# Altium project MB1397.PrjPcb (part 3 of 9)

## Sheet MotorControl.SchDoc: Motor Control
size A3; Date: Not used; ApprovedBy: Not used; CheckedBy: Not used; Author: Not used; CompanyName: STMicroelectronics; DrawnBy: Not used; Engineer: Not used; Organization: Not used; Address1: Not used; Address2: Not used; Address3: Not used; Address4: Not used; DocumentNumber: Not used; Revision: Not used; SheetNumber: 16; SheetTotal: 22; CurrentTime: Not used; CurrentDate: Not used; Time: Not used; DocumentFullPathAndName: Not used; DocumentName: Not used; ModifiedDate: Not used; ImagePath: Not used; ProjectName: Not used; Application_BuildNumber: Not used
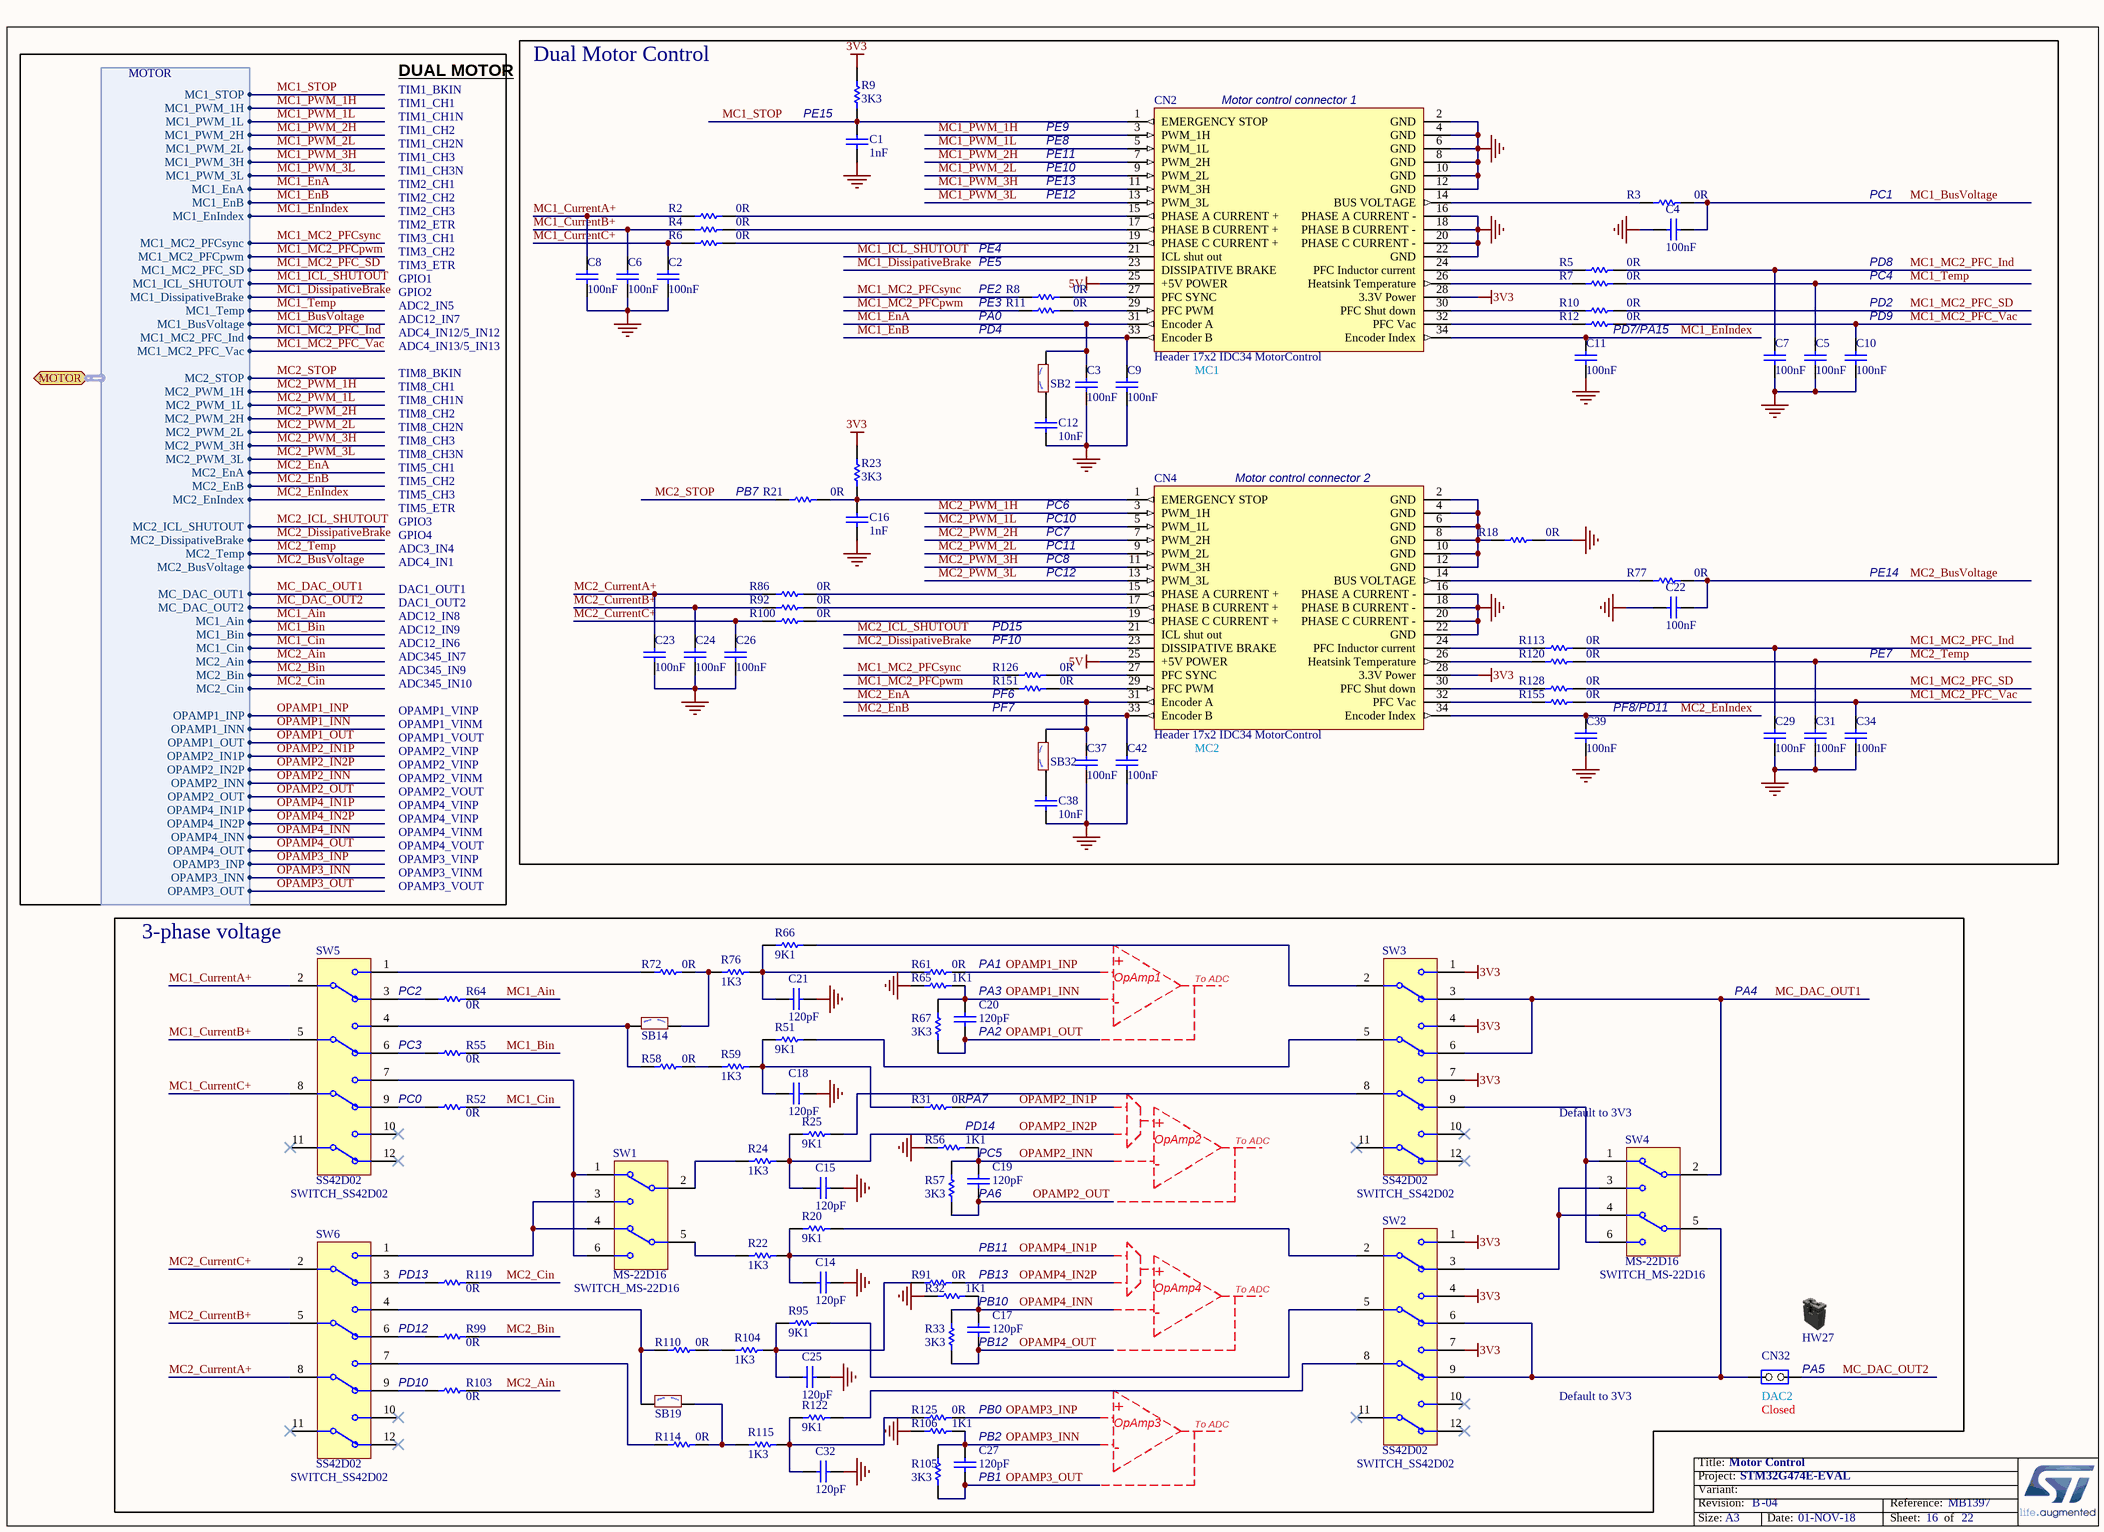
[diagram p8: MotorControl.SchDoc]

### Parts
C1  value 1nF  [C0402]  (hidden comment: Capacitor)
C2  value 100nF  [C0402]  (hidden comment: Capacitor)
C3  value 100nF  [C0402]  (hidden comment: Capacitor)
C4  value 100nF  [C0402]  (hidden comment: Capacitor)
C5  value 100nF  [C0402]  (hidden comment: Capacitor)
C6  value 100nF  [C0402]  (hidden comment: Capacitor)
C7  value 100nF  [C0402]  (hidden comment: Capacitor)
C8  value 100nF  [C0402]  (hidden comment: Capacitor)
C9  value 100nF  [C0402]  (hidden comment: Capacitor)
C10  value 100nF  [C0402]  (hidden comment: Capacitor)
C11  value 100nF  [C0402]  (hidden comment: Capacitor)
C12  value 10nF  [C0402]  (hidden comment: Capacitor)
C14  value 120pF  [C0603]  (hidden comment: Capacitor)
C15  value 120pF  [C0603]  (hidden comment: Capacitor)
C16  value 1nF  [C0402]  (hidden comment: Capacitor)
C17  value 120pF  [C0603]  (hidden comment: Capacitor)
C18  value 120pF  [C0603]  (hidden comment: Capacitor)
C19  value 120pF  [C0603]  (hidden comment: Capacitor)
C20  value 120pF  [C0603]  (hidden comment: Capacitor)
C21  value 120pF  [C0603]  (hidden comment: Capacitor)
C22  value 100nF  [C0402]  (hidden comment: Capacitor)
C23  value 100nF  [C0402]  (hidden comment: Capacitor)
C24  value 100nF  [C0402]  (hidden comment: Capacitor)
C25  value 120pF  [C0603]  (hidden comment: Capacitor)
C26  value 100nF  [C0402]  (hidden comment: Capacitor)
C27  value 120pF  [C0603]  (hidden comment: Capacitor)
C29  value 100nF  [C0402]  (hidden comment: Capacitor)
C31  value 100nF  [C0402]  (hidden comment: Capacitor)
C32  value 120pF  [C0603]  (hidden comment: Capacitor)
C34  value 100nF  [C0402]  (hidden comment: Capacitor)
C37  value 100nF  [C0402]  (hidden comment: Capacitor)
C38  value 10nF  [C0402]  (hidden comment: Capacitor)
C39  value 100nF  [C0402]  (hidden comment: Capacitor)
C42  value 100nF  [C0402]  (hidden comment: Capacitor)
CN2  Header 17x2 IDC34 MotorControl  [CON_SAMTEC_TST-117-01-T-D]
CN4  Header 17x2 IDC34 MotorControl  [CON_SAMTEC_TST-117-01-T-D]
CN32  Jumper_Header 2x1  [CON_SAMTEC_TSW-102-07-G-S]  (value not drawn)
HW27  Shunt Black 2.54mm  (value not drawn)  (mechanical)
R2  value 0R  [R0603]  (hidden comment: Resistor)
R3  value 0R  [R0603]  (hidden comment: Resistor)
R4  value 0R  [R0603]  (hidden comment: Resistor)
R5  value 0R  [R0603]  (hidden comment: Resistor)
R6  value 0R  [R0603]  (hidden comment: Resistor)
R7  value 0R  [R0603]  (hidden comment: Resistor)
R8  value 0R  [R0603]  (hidden comment: Resistor)
R9  value 3K3  [R0402]  (hidden comment: Resistor)
R10  value 0R  [R0603]  (hidden comment: Resistor)
R11  value 0R  [R0603]  (hidden comment: Resistor)
R12  value 0R  [R0603]  (hidden comment: Resistor)
R18  value 0R  [R0603]  (hidden comment: Resistor)
R20  value 9K1  [R0603]  (hidden comment: Resistor)
R21  value 0R  [R0603]  (hidden comment: Resistor)
R22  value 1K3  [R0603]  (hidden comment: Resistor)
R23  value 3K3  [R0402]  (hidden comment: Resistor)
R24  value 1K3  [R0603]  (hidden comment: Resistor)
R25  value 9K1  [R0603]  (hidden comment: Resistor)
R31  value 0R  [R0603]  (hidden comment: Resistor)
R32  value 1K1  [R0603]  (hidden comment: Resistor)
R33  value 3K3  [R0603]  (hidden comment: Resistor)
R51  value 9K1  [R0603]  (hidden comment: Resistor)
R52  value 0R  [R0603]  (hidden comment: Resistor)
R55  value 0R  [R0603]  (hidden comment: Resistor)
R56  value 1K1  [R0603]  (hidden comment: Resistor)
R57  value 3K3  [R0603]  (hidden comment: Resistor)
R58  value 0R  [R0603]  (hidden comment: Resistor)
R59  value 1K3  [R0603]  (hidden comment: Resistor)
R61  value 0R  [R0603]  (hidden comment: Resistor)
R64  value 0R  [R0603]  (hidden comment: Resistor)
R65  value 1K1  [R0603]  (hidden comment: Resistor)
R66  value 9K1  [R0603]  (hidden comment: Resistor)
R67  value 3K3  [R0603]  (hidden comment: Resistor)
R72  value 0R  [R0603]  (hidden comment: Resistor)
R76  value 1K3  [R0603]  (hidden comment: Resistor)
R77  value 0R  [R0603]  (hidden comment: Resistor)
R86  value 0R  [R0603]  (hidden comment: Resistor)
R91  value 0R  [R0603]  (hidden comment: Resistor)
R92  value 0R  [R0603]  (hidden comment: Resistor)
R95  value 9K1  [R0603]  (hidden comment: Resistor)
R99  value 0R  [R0603]  (hidden comment: Resistor)
R100  value 0R  [R0603]  (hidden comment: Resistor)
R103  value 0R  [R0603]  (hidden comment: Resistor)
R104  value 1K3  [R0603]  (hidden comment: Resistor)
R105  value 3K3  [R0603]  (hidden comment: Resistor)
R106  value 1K1  [R0603]  (hidden comment: Resistor)
R110  value 0R  [R0603]  (hidden comment: Resistor)
R113  value 0R  [R0603]  (hidden comment: Resistor)
R114  value 0R  [R0603]  (hidden comment: Resistor)
R115  value 1K3  [R0603]  (hidden comment: Resistor)
R119  value 0R  [R0603]  (hidden comment: Resistor)
R120  value 0R  [R0603]  (hidden comment: Resistor)
R122  value 9K1  [R0603]  (hidden comment: Resistor)
R125  value 0R  [R0603]  (hidden comment: Resistor)
R126  value 0R  [R0603]  (hidden comment: Resistor)
R128  value 0R  [R0603]  (hidden comment: Resistor)
R151  value 0R  [R0603]  (hidden comment: Resistor)
R155  value 0R  [R0603]  (hidden comment: Resistor)
SB2  SB_OFF  [SOLDER-BRIDGE_R0603-0R]  (value not drawn)
SB14  SB_OFF  [SOLDER-BRIDGE_R0603-0R]  (value not drawn)
SB19  SB_OFF  [SOLDER-BRIDGE_R0603-0R]  (value not drawn)
SB32  SB_OFF  [SOLDER-BRIDGE_R0603-0R]  (value not drawn)
SW1  SWITCH_MS-22D16  value MS-22D16  [SWI_DHS-ELECTRONICS_MS-22D16_2P2T]
SW2  SWITCH_SS42D02  value SS42D02  [SWI_DHS-ELECTRONICS_SS42D02_4P2T]
SW3  SWITCH_SS42D02  value SS42D02  [SWI_DHS-ELECTRONICS_SS42D02_4P2T]
SW4  SWITCH_MS-22D16  value MS-22D16  [SWI_DHS-ELECTRONICS_MS-22D16_2P2T]
SW5  SWITCH_SS42D02  value SS42D02  [SWI_DHS-ELECTRONICS_SS42D02_4P2T]
SW6  SWITCH_SS42D02  value SS42D02  [SWI_DHS-ELECTRONICS_SS42D02_4P2T]

### Blocks framed on the sheet
Dual Motor Control: C1-C12 C16 C22-C24 C26 C29 C31 C34 C37-C39 C42 CN2 CN4 R2-R12 R18 R21 R23 R77 R86 R92 R100 R113 R120 R126 R128 R151 R155 SB2 SB32
3-phase voltage: C14 C15 C17-C21 C25 C27 C32 CN32 HW27 R20 R22 R24 R25 R31-R33 R51 R52 R55-R59 R61 R64-R67 R72 R76 R91 R95 R99 R103-R106 R110 R114 R115 R119 R122 R125 SB14 SB19 SW1-SW6

### Ports
MOTOR (harness MOTOR)

### Harnesses
MOTOR: MC1_PWM_1H, MC1_PWM_1L, MC1_PWM_2H, MC1_PWM_2L, MC1_PWM_3H, MC1_PWM_3L, MC1_STOP, MC1_EnA, MC1_EnB, MC1_EnIndex, MC1_MC2_PFCsync, MC1_MC2_PFCpwm, MC1_MC2_PFC_SD, MC1_ICL_SHUTOUT, MC1_DissipativeBrake, MC1_Temp, MC1_BusVoltage, MC1_MC2_PFC_Ind, MC1_MC2_PFC_Vac, MC2_STOP, MC2_PWM_1H, MC2_PWM_1L, MC2_PWM_2H, MC2_PWM_2L, MC2_PWM_3H, MC2_PWM_3L, MC2_EnA, MC2_EnB, MC2_EnIndex, MC2_ICL_SHUTOUT, MC2_DissipativeBrake, MC2_Temp, MC2_BusVoltage, MC_DAC_OUT1, MC_DAC_OUT2, MC1_Ain, MC1_Bin, MC1_Cin, MC2_Ain, MC2_Bin, MC2_Cin, OPAMP1_INP, OPAMP1_INN, OPAMP1_OUT, OPAMP2_IN1P, OPAMP2_IN2P, OPAMP2_INN, OPAMP2_OUT, OPAMP4_IN1P, OPAMP4_IN2P, OPAMP4_INN, OPAMP4_OUT, OPAMP3_INP, OPAMP3_INN, OPAMP3_OUT

### Nets
3V3: CN2.28(3.3V_Power) CN4.28(3.3V_Power) R9.2 R23.2 SW2.1 SW2.4 SW2.7 SW3.1 SW3.4 SW3.7
5V: CN2.25(+5V_POWER) CN4.25(+5V_POWER)
GND: C1.1 C2.1 C3.1 C4.2 C5.1 C6.1 C7.1 C8.1 C9.1 C10.1 C11.1 C12.1 C14.2 C15.2 C16.1 C18.2 C21.2 C22.2 C23.1 C24.1 C25.2 C26.1 C29.1 C31.1 C32.2 C34.1 C37.1 C38.1 C39.1 C42.1 CN2.2(GND) CN2.4(GND) CN2.6(GND) CN2.8(GND) CN2.10(GND) CN2.12(GND) CN2.16(PHASE_A_CURRENT_-) CN2.18(PHASE_B_CURRENT_-) CN2.20(PHASE_C_CURRENT_-) CN2.22(GND) CN4.16(PHASE_A_CURRENT_-) CN4.18(PHASE_B_CURRENT_-) CN4.20(PHASE_C_CURRENT_-) CN4.22(GND) R18.2 R32.1 R56.1 R65.1 R106.1
MC1_Ain: R64.2 ; port MOTOR.MC1_Ain
MC1_Bin: R55.2 ; port MOTOR.MC1_Bin
MC1_BusVoltage: C4.1 R3.2 ; port MOTOR.MC1_BusVoltage
MC1_Cin: R52.2 ; port MOTOR.MC1_Cin
MC1_CurrentA+: C8.2 R2.1 SW5.2
MC1_CurrentB+: C6.2 R4.1 SW5.5
MC1_CurrentC+: C2.2 R6.1 SW5.8
MC1_DissipativeBrake: CN2.23(DISSIPATIVE_BRAKE) ; port MOTOR.MC1_DissipativeBrake
MC1_EnA: C3.2 CN2.31(Encoder_A) SB2.1 ; port MOTOR.MC1_EnA
MC1_EnB: C9.2 CN2.33(Encoder_B) ; port MOTOR.MC1_EnB
MC1_EnIndex: C11.2 CN2.34(Encoder_Index) ; port MOTOR.MC1_EnIndex
MC1_ICL_SHUTOUT: CN2.21(ICL_shut_out) ; port MOTOR.MC1_ICL_SHUTOUT
MC1_MC2_PFC_Ind: C7.2 C29.2 R5.2 R113.2 ; port MOTOR.MC1_MC2_PFC_Ind
MC1_MC2_PFC_SD: R10.2 R128.2 ; port MOTOR.MC1_MC2_PFC_SD
MC1_MC2_PFC_Vac: C10.2 C34.2 R12.2 R155.2 ; port MOTOR.MC1_MC2_PFC_Vac
MC1_MC2_PFCpwm: R11.1 R151.1 ; port MOTOR.MC1_MC2_PFCpwm
MC1_MC2_PFCsync: R8.1 R126.1 ; port MOTOR.MC1_MC2_PFCsync
MC1_PWM_1H: CN2.3(PWM_1H) ; port MOTOR.MC1_PWM_1H
MC1_PWM_1L: CN2.5(PWM_1L) ; port MOTOR.MC1_PWM_1L
MC1_PWM_2H: CN2.7(PWM_2H) ; port MOTOR.MC1_PWM_2H
MC1_PWM_2L: CN2.9(PWM_2L) ; port MOTOR.MC1_PWM_2L
MC1_PWM_3H: CN2.11(PWM_3H) ; port MOTOR.MC1_PWM_3H
MC1_PWM_3L: CN2.13(PWM_3L) ; port MOTOR.MC1_PWM_3L
MC1_STOP: C1.2 CN2.1(EMERGENCY_STOP) R9.1 ; port MOTOR.MC1_STOP
MC1_Temp: C5.2 R7.2 ; port MOTOR.MC1_Temp
MC2_Ain: R103.2 ; port MOTOR.MC2_Ain
MC2_Bin: R99.2 ; port MOTOR.MC2_Bin
MC2_BusVoltage: C22.1 R77.2 ; port MOTOR.MC2_BusVoltage
MC2_Cin: R119.2 ; port MOTOR.MC2_Cin
MC2_CurrentA+: C23.2 R86.1 SW6.8
MC2_CurrentB+: C24.2 R92.1 SW6.5
MC2_CurrentC+: C26.2 R100.1 SW6.2
MC2_DissipativeBrake: CN4.23(DISSIPATIVE_BRAKE) ; port MOTOR.MC2_DissipativeBrake
MC2_EnA: C37.2 CN4.31(Encoder_A) SB32.1 ; port MOTOR.MC2_EnA
MC2_EnB: C42.2 CN4.33(Encoder_B) ; port MOTOR.MC2_EnB
MC2_EnIndex: C39.2 CN4.34(Encoder_Index) ; port MOTOR.MC2_EnIndex
MC2_ICL_SHUTOUT: CN4.21(ICL_shut_out) ; port MOTOR.MC2_ICL_SHUTOUT
MC2_PWM_1H: CN4.3(PWM_1H) ; port MOTOR.MC2_PWM_1H
MC2_PWM_1L: CN4.5(PWM_1L) ; port MOTOR.MC2_PWM_1L
MC2_PWM_2H: CN4.7(PWM_2H) ; port MOTOR.MC2_PWM_2H
MC2_PWM_2L: CN4.9(PWM_2L) ; port MOTOR.MC2_PWM_2L
MC2_PWM_3H: CN4.11(PWM_3H) ; port MOTOR.MC2_PWM_3H
MC2_PWM_3L: CN4.13(PWM_3L) ; port MOTOR.MC2_PWM_3L
MC2_STOP: R21.1 ; port MOTOR.MC2_STOP
MC2_Temp: C31.2 R120.2 ; port MOTOR.MC2_Temp
MC_DAC_OUT1: SW3.3 SW3.6 SW4.2 ; port MOTOR.MC_DAC_OUT1
MC_DAC_OUT2: CN32.1(COMMON) ; port MOTOR.MC_DAC_OUT2
OPAMP1_INN: C20.1 R65.2 R67.2 ; port MOTOR.OPAMP1_INN
OPAMP1_INP: R61.2 ; port MOTOR.OPAMP1_INP
OPAMP1_OUT: C20.2 R67.1 ; port MOTOR.OPAMP1_OUT
OPAMP2_IN1P: R31.2 ; port MOTOR.OPAMP2_IN1P
OPAMP2_IN2P: C15.1 R24.2 R25.1 ; port MOTOR.OPAMP2_IN2P
OPAMP2_INN: C19.1 R56.2 R57.2 ; port MOTOR.OPAMP2_INN
OPAMP2_OUT: C19.2 R57.1 ; port MOTOR.OPAMP2_OUT
OPAMP3_INN: C27.1 R105.2 R106.2 ; port MOTOR.OPAMP3_INN
OPAMP3_INP: R125.2 ; port MOTOR.OPAMP3_INP
OPAMP3_OUT: C27.2 R105.1 ; port MOTOR.OPAMP3_OUT
OPAMP4_IN1P: C14.1 R20.1 R22.2 ; port MOTOR.OPAMP4_IN1P
OPAMP4_IN2P: R91.2 ; port MOTOR.OPAMP4_IN2P
OPAMP4_INN: C17.1 R32.2 R33.2 ; port MOTOR.OPAMP4_INN
OPAMP4_OUT: C17.2 R33.1 ; port MOTOR.OPAMP4_OUT
NetC12_2: C12.2 SB2.2
NetC16_2: C16.2 CN4.1(EMERGENCY_STOP) R21.2 R23.1
NetC18_1: C18.1 R31.1 R51.1 R59.2
NetC21_1: C21.1 R61.1 R66.1 R76.2
NetC25_1: C25.1 R91.1 R95.1 R104.2
NetC32_1: C32.1 R115.2 R122.1 R125.1
NetC38_2: C38.2 SB32.2
NetCN2_14: CN2.14(BUS_VOLTAGE) R3.1
NetCN2_15: CN2.15(PHASE_A_CURRENT_+) R2.2
NetCN2_17: CN2.17(PHASE_B_CURRENT_+) R4.2
NetCN2_19: CN2.19(PHASE_C_CURRENT_+) R6.2
NetCN2_24: CN2.24(PFC_Inductor_current) R5.1
NetCN2_26: CN2.26(Heatsink_Temperature) R7.1
NetCN2_27: CN2.27(PFC_SYNC) R8.2
NetCN2_29: CN2.29(PFC_PWM) R11.2
NetCN2_30: CN2.30(PFC_Shut_down) R10.1
NetCN2_32: CN2.32(PFC_Vac) R12.1
NetCN4_2: CN4.2(GND) CN4.4(GND) CN4.6(GND) CN4.8(GND) CN4.10(GND) CN4.12(GND) R18.1
NetCN4_14: CN4.14(BUS_VOLTAGE) R77.1
NetCN4_15: CN4.15(PHASE_A_CURRENT_+) R86.2
NetCN4_17: CN4.17(PHASE_B_CURRENT_+) R92.2
NetCN4_19: CN4.19(PHASE_C_CURRENT_+) R100.2
NetCN4_24: CN4.24(PFC_Inductor_current) R113.1
NetCN4_26: CN4.26(Heatsink_Temperature) R120.1
NetCN4_27: CN4.27(PFC_SYNC) R126.2
NetCN4_29: CN4.29(PFC_PWM) R151.2
NetCN4_30: CN4.30(PFC_Shut_down) R128.1
NetCN4_32: CN4.32(PFC_Vac) R155.1
NetCN32_2: CN32.2(NO) SW2.6 SW2.9 SW4.5
NetR20_2: R20.2 SW2.2
NetR22_1: R22.1 SW1.5
NetR24_1: R24.1 SW1.2
NetR25_2: R25.2 SW3.8
NetR51_2: R51.2 SW3.5
NetR52_1: R52.1 SW5.9
NetR55_1: R55.1 SW5.6
NetR58_1: R58.1 SB14.1 SW5.4
NetR58_2: R58.2 R59.1
NetR64_1: R64.1 SW5.3
NetR66_2: R66.2 SW3.2
NetR72_1: R72.1 SW5.1
NetR72_2: R72.2 R76.1 SB14.2
NetR95_2: R95.2 SW2.5
NetR99_1: R99.1 SW6.6
NetR103_1: R103.1 SW6.9
NetR104_1: R104.1 R110.2
NetR110_1: R110.1 SB19.1 SW6.4
NetR114_1: R114.1 SW6.7
NetR114_2: R114.2 R115.1 SB19.2
NetR119_1: R119.1 SW6.3
NetR122_2: R122.2 SW2.8
NetSW1_1: SW1.1 SW1.6 SW5.7
NetSW1_3: SW1.3 SW1.4 SW6.1
NetSW2_3: SW2.3 SW4.3 SW4.4
NetSW3_9: SW3.9 SW4.1 SW4.6

Not connected (* = marked no-connect by the designer): SW2 10* 11* 12*; SW3 10* 11* 12*; SW5 10* 11* 12*; SW6 10* 11* 12*

### Notes on the sheet
- DUAL MOTOR
- PE15
- PE9
- (near CN2) Motor control connector 1
- PE8
- PE11
- PE10
- PE13
- PE12
- PC1
- PE5
- PE4
- PD8
- PA0
- PD4
- PE2
- PE3
- (near R12) PD7/PA15
- PC4
- PD2
- (near C10) PD9
- (near CN2) MC1
- (near R21) PB7
- PC6
- PC10
- PC7
- (near CN4) Motor control connector 2
- PC11
- PC8
- PC12
- PE14
- PF10
- PD15
- PE7
- PF6
- (near R151) PF7
- PF8/PD11
- (near CN4) MC2
- TIM1_BKIN
  TIM1_CH1
  TIM1_CH1N
  TIM1_CH2
  TIM1_CH2N
  TIM1_CH3
  TIM1_CH3N
  TIM2_CH1
  TIM2_CH2
  TIM2_CH3
  TIM2_ETR
  TIM3_CH1
  TIM3_CH2
  TIM3_ETR
  GPIO1
  GPIO2
  ADC2_IN5
  ADC12_IN7
  ADC4_IN12/5_IN12
  ADC4_IN13/5_IN13
  TIM8_BKIN
  TIM8_CH1
  TIM8_CH1N
  TIM8_CH2
  TIM8_CH2N
  TIM8_CH3
  TIM8_CH3N
  TIM5_CH1
  TIM5_CH2
  TIM5_CH3
  TIM5_ETR
  GPIO3
  GPIO4
  ADC3_IN4
  ADC4_IN1
  DAC1_OUT1
  DAC1_OUT2
  ADC12_IN8
  ADC12_IN9
  ADC12_IN6
  ADC345_IN7
  ADC345_IN9
  ADC345_IN10
  OPAMP1_VINP
  OPAMP1_VINM
  OPAMP1_VOUT
  OPAMP2_VINP
  OPAMP2_VINP
  OPAMP2_VINM
  OPAMP2_VOUT
  OPAMP4_VINP
  OPAMP4_VINP
  OPAMP4_VINM
  OPAMP4_VOUT
  OPAMP3_VINP
  OPAMP3_VINM
  OPAMP3_VOUT
- PC2
- PA1
- PA3
- +
- -
- OpAmp1
- To ADC
- PA4
- PC3
- (near C20) PA2
- PC0
- (near R31) PA7
- PD14
- OpAmp2
- (near SW3) Default to 3V3
- PC5
- (near C19) PA6
- PD13
- PB11
- PB13
- PD12
- PB10
- (near C17) PB12
- OpAmp4
- PD10
- PB0
- (near SW2) Default to 3V3
- (near CN32) DAC2
- (near CN32) Closed
- (near CN32) PA5
- PB2
- (near C27) PB1
- OpAmp3
- Title:
- Project:
- Size:
- Revision:
- Variant:
- A3
- Date:
- Reference:
- Sheet:
- of

### Library data of the parts
C1 C16 = MCD-00198: Capacitor, MLCC, 1nF, 16V, X7R, 10%, 0402, T=0.5mm; Manufacturer_Part_Number: CC0402KRX7R7BB102; Manufacturer: YAGEO; Provided_By: SUBCO; Initial_Board_Reference: MBxxxx; Path: ws/MCD_ApplicationBoards/Lists/MCDPARTSdatabase; Item Type: Item; Internal_Part_Number: MCD-00198; Status: Released; Part_Type: Capacitor; Package: C0402; ComponentLink1Description: Datasheet; ComponentLink1URL: http://tunmcdsvn.tun.st.com/Component_Datasheet_Library/Trunk/Capacitors/Yageo_Multilayer_Capacitor_X7R_series_100pF_to_22uF
C2-C11 C22-C24 C26 C29 C31 C34 C37 C39 C42 = MCD-00006: as C93 on sheet Audio; Internal_Part_Number: MCD-00006; Status: Released; Part_Type: Capacitor; Package: C0402; ComponentLink1Description: Datasheet; ComponentLink1URL: http://tunmcdsvn.tun.st.com/Component_Datasheet_Library/Trunk/Capacitors/Yageo_Multilayer_Capacitor_X7R_series_100pF_to_22uF
C12 C38 = MCD-00011: Capacitor, MLCC, 10nF, 16V, X7R, 10%, 0402, T=0.5mm; Manufacturer_Part_Number: CC0402KRX7R7BB103; Manufacturer: YAGEO; Provided_By: SUBCO; Initial_Board_Reference: MB1274; Path: ws/MCD_ApplicationBoards/Lists/MCDPARTSdatabase; Item Type: Item; Internal_Part_Number: MCD-00011; Status: Released; Part_Type: Capacitor; Package: C0402; ComponentLink1Description: Datasheet; ComponentLink1URL: http://tunmcdsvn.tun.st.com/Component_Datasheet_Library/Trunk/Capacitors/Yageo_Multilayer_Capacitor_X7R_series_100pF_to_22uF
C14 C15 C17-C21 C25 C27 C32 = MCD-01188: Capacitor,120pF,50V,NPO,5%,0603; Manufacturer_Part_Number: CC0603JRNPO9BN121; Manufacturer: YAGEO; Provided_By: SUBCO; Initial_Board_Reference: MB1397; Remark: MPN is confirm, even if datasheet not mention it.Eric: updated new MPN with new datasheet.; Path: ws/MCD_ApplicationBoards/Lists/MCDPARTSdatabase; Item Type: Item; Internal_Part_Number: MCD-01188; Status: Released; Part_Type: Capacitor; ComponentLink1Description: Datasheet; ComponentLink1URL: http://tunmcdsvn.tun.st.com/Component_Datasheet_Library/Trunk/Capacitors/Yageo_UPY-GP_NP0_16V-to-50V
CN2 CN4 = MCD-00583: Header, 17x2, 2.54mm, VR, TH, Height 8.89mm/2.92mm, shrouded; Manufacturer_Part_Number: TST-117-01-T-D; Manufacturer: SAMTEC; Part_Type: Connector; Alternate_Manufacturer_Part_Number: BHFS03-34G01BT1; Alternate_Manufacturer: WINPIN; Provided_By: SUBCO; Initial_Board_Reference: MB1331; Path: ws/MCD_ApplicationBoards/Lists/MCDPARTSdatabase; Item Type: Item; Internal_Part_Number: MCD-00583; Value: Header 17x2 IDC34 MotorControl; Status: Released; ComponentLink1Description: Datasheet; ComponentLink1URL: http://tunmcdsvn.tun.st.com/Component_Datasheet_Library/Trunk/Connectors/Samtec_TST-series
CN32 = MCD-00045: as JP2 on sheet FDCAN; Internal_Part_Number: MCD-00045; ComponentLink1Description: Datasheet; Status: Released; ComponentLink1URL: http://tunmcdsvn.tun.st.com/Component_Datasheet_Library/Trunk/Connectors/Samtec_TSW-HTSW-series
HW27 = MCD-00043: SHUNT 2.54mm BLACK; Part_Type: Mechanical; Manufacturer_Part_Number: SNT-100-BK-G; Manufacturer: SAMTEC; Provided_By: SUBCO; Initial_Board_Reference: MB1274; Value: SNT-100-BK-G; Path: ws/MCD_ApplicationBoards/Lists/MCDPARTSdatabase; Item Type: Item; Internal_Part_Number: MCD-00043; Status: Released; ComponentLink1Description: Datasheet; ComponentLink1URL: http://tunmcdsvn.tun.st.com/Component_Datasheet_Library/Trunk/Connectors/Samtec_Shunt_Jumper_SNT100
R2-R8 R10-R12 R18 R21 R31 R52 R55 R58 R61 R64 R72 R77 R86 R91 R92 R99 R100 R103 R110 R113 R114 R119 R120 R125 R126 R128 R151 R155 = MCD-00056: as R257 on sheet Audio; Internal_Part_Number: MCD-00056; Status: Released; Part_Type: Resistor; Package: R0603; ComponentLink1Description: Datasheet; ComponentLink1URL: http://tunmcdsvn.tun.st.com/Component_Datasheet_Library/Trunk/Resistors/Yageo_Resistor_RC0603-series
R9 R23 = MCD-00184: Resistor,3K3,0402,1%,1/16W; Manufacturer_Part_Number: RC0402FR-073K3L; Manufacturer: YAGEO; Provided_By: SUBCO; Initial_Board_Reference: MBxxxx; Path: ws/MCD_ApplicationBoards/Lists/MCDPARTSdatabase; Item Type: Item; Internal_Part_Number: MCD-00184; Status: Released; Part_Type: Resistor; Package: R0402; ComponentLink1Description: Datasheet; ComponentLink1URL: http://tunmcdsvn.tun.st.com/Component_Datasheet_Library/Trunk/Resistors/Yageo_Resistor_RC0402-series
R20 R25 R51 R66 R95 R122 = MCD-00540: Resistor,9K1,0603,1%,1/10W; Manufacturer_Part_Number: RC0603FR-079K1L; Manufacturer: YAGEO; Provided_By: SUBCO; Initial_Board_Reference: MBxxxx; Path: ws/MCD_ApplicationBoards/Lists/MCDPARTSdatabase; Item Type: Item; Internal_Part_Number: MCD-00540; Status: Released; Part_Type: Resistor; Package: R0603; ComponentLink1Description: Datasheet; ComponentLink1URL: http://tunmcdsvn.tun.st.com/Component_Datasheet_Library/Trunk/Resistors/Yageo_Resistor_RC0603-series
R22 R24 R59 R76 R104 R115 = MCD-00382: Resistor,1K3,0603,1%,1/10W; Manufacturer_Part_Number: RC0603FR-071K3L; Manufacturer: YAGEO; Provided_By: SUBCO; Initial_Board_Reference: MBxxxx; Path: ws/MCD_ApplicationBoards/Lists/MCDPARTSdatabase; Item Type: Item; Internal_Part_Number: MCD-00382; Status: Released; Part_Type: Resistor; Package: R0603; ComponentLink1Description: Datasheet; ComponentLink1URL: http://tunmcdsvn.tun.st.com/Component_Datasheet_Library/Trunk/Resistors/Yageo_Resistor_RC0603-series
R32 R56 R65 R106 = MCD-00364: Resistor,1K1,0603,1%,1/10W; Manufacturer_Part_Number: RC0603FR-071K1L; Manufacturer: YAGEO; Provided_By: SUBCO; Initial_Board_Reference: MBxxxx; Path: ws/MCD_ApplicationBoards/Lists/MCDPARTSdatabase; Item Type: Item; Internal_Part_Number: MCD-00364; Status: Released; Part_Type: Resistor; Package: R0603; ComponentLink1Description: Datasheet; ComponentLink1URL: http://tunmcdsvn.tun.st.com/Component_Datasheet_Library/Trunk/Resistors/Yageo_Resistor_RC0603-series
R33 R57 R67 R105 = MCD-00352: Resistor,3K3,0603,1%,1/10W; Manufacturer_Part_Number: RC0603FR-073K3L; Manufacturer: YAGEO; Provided_By: SUBCO; Initial_Board_Reference: MBxxxx; Path: ws/MCD_ApplicationBoards/Lists/MCDPARTSdatabase; Item Type: Item; Internal_Part_Number: MCD-00352; Status: Released; Part_Type: Resistor; Package: R0603; ComponentLink1Description: Datasheet; ComponentLink1URL: http://tunmcdsvn.tun.st.com/Component_Datasheet_Library/Trunk/Resistors/Yageo_Resistor_RC0603-series
SB2 SB14 SB19 SB32 = MCD-00072: as SB36 on sheet QSPI Memory; Internal_Part_Number: MCD-00072; Status: Released; ComponentLink1Description: Datasheet; Package: SB0603; ComponentLink1URL: http://tunmcdsvn.tun.st.com/Component_Datasheet_Library/Trunk/Resistors/Yageo_Resistor_RC0603-series
SW1 SW4 = MCD-01180: vertical slider switch 2x(A to 2B); Part_Type: Connector; Manufacturer: Dongguan Huan Sheng Electronics Co.,Ltd.; Provided_By: SUBCO; Initial_Board_Reference: MB1397; Path: ws/MCD_ApplicationBoards/Lists/MCDPARTSdatabase; Item Type: Item; Internal_Part_Number: MCD-01180; Status: Checked; Manufacturer_Part_Number: MS-22D16; ComponentLink1Description: Datasheet; ComponentLink1URL: http://tunmcdsvn.tun.st.com/Component_Datasheet_Library/Trunk/Connectors/HS_MS-22D16
SW2 SW3 SW5 SW6 = MCD-01179: Vertical slide switch 4x (A to 2B); Part_Type: Connector; Manufacturer: Dongguan Huan Sheng Electronics Co.,Ltd.; Provided_By: SUBCO; Initial_Board_Reference: MB1397; Path: ws/MCD_ApplicationBoards/Lists/MCDPARTSdatabase; Item Type: Item; Internal_Part_Number: MCD-01179; Status: Checked; Manufacturer_Part_Number: SS42D02; ComponentLink1Description: Datasheet; ComponentLink1URL: http://tunmcdsvn.tun.st.com/Component_Datasheet_Library/Trunk/Connectors/HS_SS42D02/

## Sheet SmartCard.SchDoc: Smart Card
size A4; Date: Not used; ApprovedBy: Not used; CheckedBy: Not used; Author: Not used; CompanyName: STMicroelectronics; DrawnBy: Not used; Engineer: Not used; Organization: Not used; Address1: Not used; Address2: Not used; Address3: Not used; Address4: Not used; DocumentNumber: Not used; Revision: Not used; SheetNumber: 15; SheetTotal: 22; CurrentTime: Not used; CurrentDate: Not used; Time: Not used; DocumentFullPathAndName: Not used; DocumentName: Not used; ModifiedDate: Not used; ImagePath: Not used; ProjectName: Not used; Application_BuildNumber: Not used
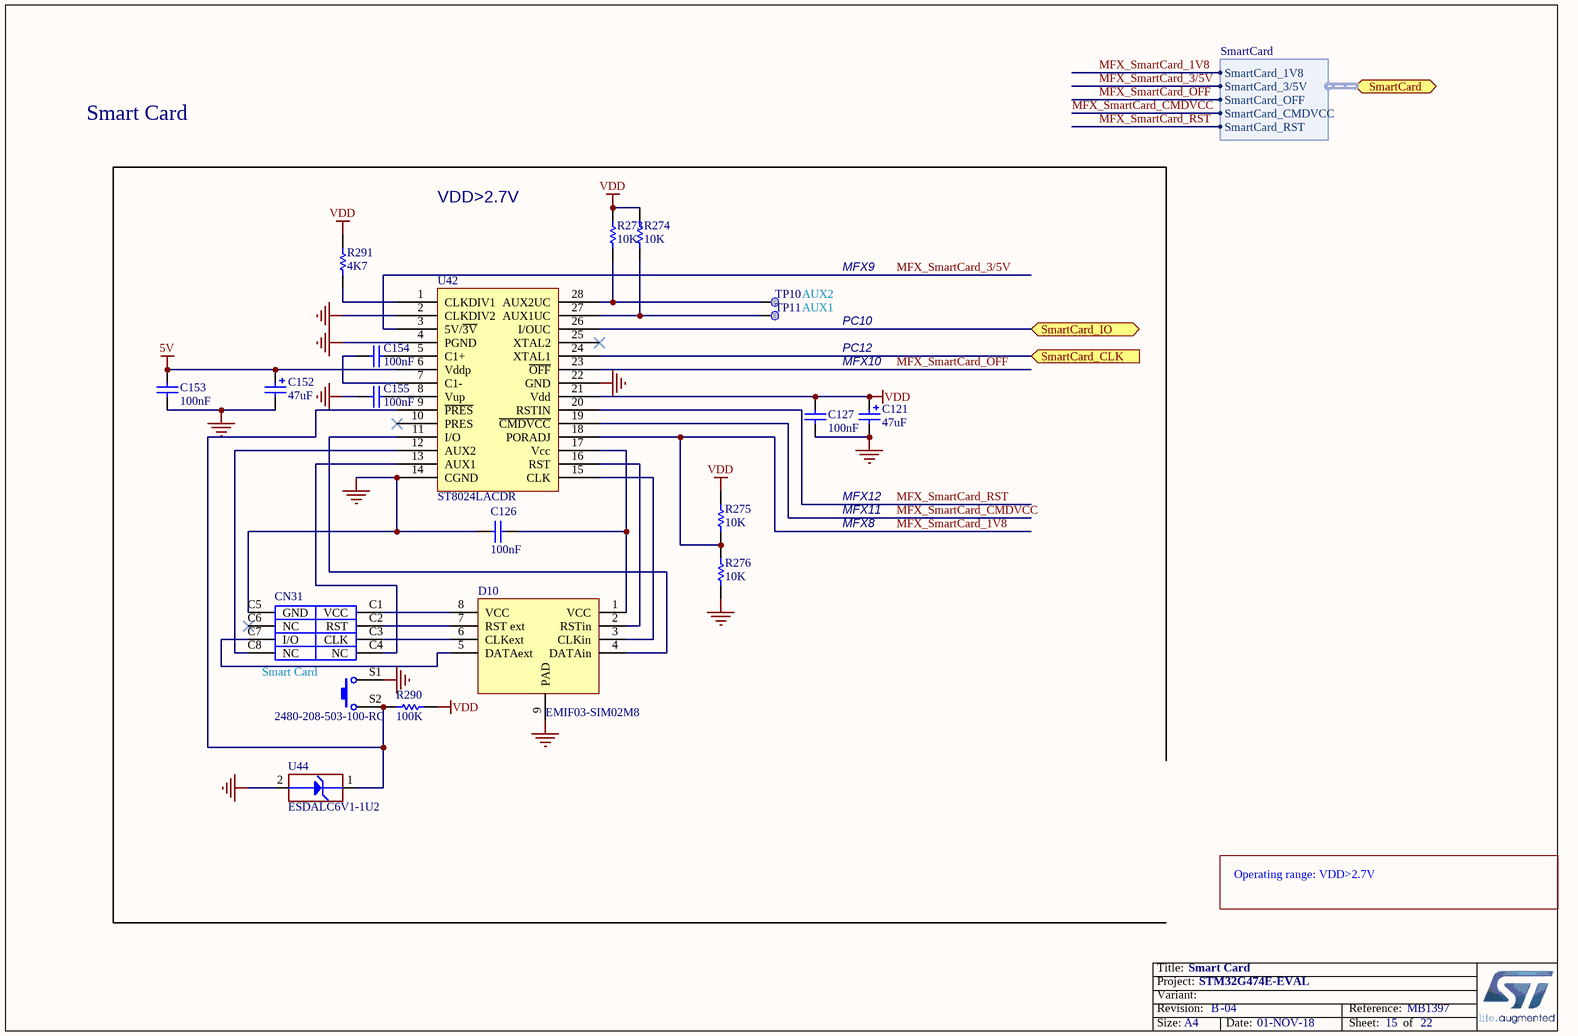
[diagram p9: SmartCard.SchDoc]

### Parts
C121  value 47uF  [CPOL_TAJ-C_2312_H2P6]  (hidden comment: Cap_POL_TANA)
C126  value 100nF  [C0603]  (hidden comment: Capacitor)
C127  value 100nF  [C0603]  (hidden comment: Capacitor)
C152  value 47uF  [CPOL_TAJ-C_2312_H2P6]  (hidden comment: Cap_POL_TANA)
C153  value 100nF  [C0603]  (hidden comment: Capacitor)
C154  value 100nF  [C0603]  (hidden comment: Capacitor)
C155  value 100nF  [C0603]  (hidden comment: Capacitor)
CN31  value 2480-208-503-100-RC  [CON_CARD-SOCKET_GUANG-LIAN-WEI_2480-208-503-100-RC]  (hidden comment: Please to check it carefuly. Pin 8 and 9 not clearly define on datasheet. Need to validate with schematics symbol)
D10  EMIF03-SIM02M8  [ESD_UQFN8-EPAD_1P7X1P5_P040]
R273  value 10K  [R0603]  (hidden comment: Resistor)
R274  value 10K  [R0603]  (hidden comment: Resistor)
R275  value 10K  [R0603]  (hidden comment: Resistor)
R276  value 10K  [R0603]  (hidden comment: Resistor)
R290  value 100K  [R0603]  (hidden comment: Resistor)
R291  value 4K7  [R0402]  (hidden comment: Resistor)
TP10  Test Point  [TP_SMD_1MM]  (value not drawn)  (no BOM)
TP11  Test Point  [TP_SMD_1MM]  (value not drawn)  (no BOM)
U42  value ST8024LACDR  [ICC_SO28_18P10X7P60_P127]  (hidden comment: ST8024CTR)
U44  value ESDALC6V1-1U2  [ESD_ST0201]  (hidden comment: ESD-TRANSIL)

### Ports
SmartCard (harness SmartCard), SmartCard_CLK (in), SmartCard_IO (bidir)

### Harnesses
SmartCard: SmartCard_1V8, SmartCard_3/5V, SmartCard_OFF, SmartCard_CMDVCC, SmartCard_RST

### Nets
5V: C152.1 C153.2 U42.6(Vddp)
GND: C121.2 C126.2 C127.1 C152.2 C153.1 C155.2 CN31.C5(GND) CN31.S1 D10.9(PAD) R276.1 U42.2(CLKDIV2) U42.4(PGND) U42.14(CGND) U42.22(GND) U44.2(GND)
VDD: C121.1 C127.2 R273.2 R274.2 R275.2 R290.2 R291.2 U42.21(Vdd)
MFX_SmartCard_1V8: R275.1 R276.2 U42.18(PORADJ) ; port SmartCard.SmartCard_1V8
MFX_SmartCard_3/5V: U42.3(5V/~{3V}) ; port SmartCard.SmartCard_3/5V
MFX_SmartCard_CMDVCC: U42.19(~{CMDVCC}) ; port SmartCard.SmartCard_CMDVCC
MFX_SmartCard_OFF: U42.23(~{OFF}) ; port SmartCard.SmartCard_OFF
MFX_SmartCard_RST: U42.20(RSTIN) ; port SmartCard.SmartCard_RST
SmartCard_CLK: U42.24(XTAL1) ; port SmartCard_CLK
SmartCard_IO: U42.26(I/OUC) ; port SmartCard_IO
NetC126_1: C126.1 D10.1(VCC) U42.17(Vcc)
NetC154_1: C154.1 U42.5(C1+)
NetC154_2: C154.2 U42.7(C1-)
NetC155_1: C155.1 U42.8(Vup)
NetCN31_C1: CN31.C1(VCC) D10.8(VCC)
NetCN31_C2: CN31.C2(RST) D10.7(RST_ext)
NetCN31_C3: CN31.C3(CLK) D10.6(CLKext)
NetCN31_C4: CN31.C4(NC) U42.13(AUX1)
NetCN31_C7: CN31.C7(I/O) D10.5(DATAext)
NetCN31_C8: CN31.C8(NC) U42.12(AUX2)
NetCN31_S2: CN31.S2 R290.1 U42.9(~{PRES}) U44.1(IO1)
NetD10_2: D10.2(RSTin) U42.16(RST)
NetD10_3: D10.3(CLKin) U42.15(CLK)
NetD10_4: D10.4(DATAin) U42.11(I/O)
NetR273_1: R273.1 TP10.1 U42.28(AUX2UC)
NetR274_1: R274.1 TP11.1 U42.27(AUX1UC)
NetR291_1: R291.1 U42.1(CLKDIV1)

Not connected (* = marked no-connect by the designer): CN31 C6(NC)*; U42 10(PRES)* 25(XTAL2)*

### Notes on the sheet
- Smart Card
- VDD>2.7V
- AUX2
- AUX1
- MFX9
- MFX10
- PC12
- PC10
- MFX12
- MFX11
- MFX8
- (near CN31) Smart Card
- Operating range: VDD>2.7V
- Title:
- Project:
- Size:
- Revision:
- Variant:
- A4
- -
- Date:
- Reference:
- Sheet:
- of

### Library data of the parts
C121 C152 = MCD-00559: Capacitor, Tantalum, 47uF, 16V, 10%, TypeC; Manufacturer_Part_Number: TAJC476K016RNJ; Manufacturer: AVX; Provided_By: SUBCO; Initial_Board_Reference: MB1331; Path: ws/MCD_ApplicationBoards/Lists/MCDPARTSdatabase; Item Type: Item; Revision: July-2002: Re-released for DXP Platform.; Internal_Part_Number: MCD-00559; Status: Footprint available; Part_Type: Capacitor; Package: C2312; ComponentLink1Description: Datasheet; ComponentLink1URL: http://tunmcdsvn.tun.st.com/Component_Datasheet_Library/Trunk/Capacitors/AVX_Capacitor_TAJ-series
C126 C127 C153-C155 = MCD-00211: as C64 on sheet LCD&SDcard; Internal_Part_Number: MCD-00211; Status: Released; Part_Type: Capacitor; Package: C0603; ComponentLink1Description: Datasheet; ComponentLink1URL: http://tunmcdsvn.tun.st.com/Component_Datasheet_Library/Trunk/Capacitors/Yageo_Multilayer_Capacitor_X7R_series_100pF_to_22uF
CN31 = Smart_card_2480-208-503-100-RC: IC Card Socket 8 pin, SMT Open for Smartcard; Internal_Part_Number: MCD-01175; Part_Type: Connector; Manufacturer: GUANG LIAN WEI; Provided_By: Subcon; Initial_Board_Reference: MB1397; Status: Footprint available; Manufacturer_Part_Number: 2480-208-503-100-RC; ComponentLink1Description: GUANG_LIAN_WEI_2480-208-503-100-RC.pdf; ComponentLink1URL: http://tunmcdsvn.tun.st.com/Component_Datasheet_Library/Trunk/Connectors/GUANG_LIAN_WEI_2480-208-503-100-RC; ECCN_US: n/a; ECCN_EU: n/a
D10 = MCD-01229: 3 line IPAD, EMI filter for SIM card applications; Part_Type: Diode; Manufacturer: STMICROELECTRONICS; BMS_Part_Number: 9179047; Provided_By: SUBCO with ST control; Initial_Board_Reference: MB1397; Path: ws/MCD_ApplicationBoards/Lists/MCDPARTSdatabase; Item Type: Item; Internal_Part_Number: MCD-01229; Value: EMIF03-SIM02M8; Status: Released; Manufacturer_Part_Number: EMIF03-SIM02M8; ComponentLink1Description: Datasheet; ComponentLink1URL: http://tunmcdsvn.tun.st.com/Component_Datasheet_Library/Trunk/Diodes/STM_ESD_EMIF03-SIM02M8
R273-R276 = MCD-00220: as R219 on sheet LCD&SDcard; Internal_Part_Number: MCD-00220; Status: Released; Part_Type: Resistor; Package: R0603; ComponentLink1Description: Datasheet; ComponentLink1URL: http://tunmcdsvn.tun.st.com/Component_Datasheet_Library/Trunk/Resistors/Yageo_Resistor_RC0603-series
R290 = MCD-00223: as R218 on sheet LCD&SDcard; Internal_Part_Number: MCD-00223; Status: Released; Part_Type: Resistor; Package: R0603; ComponentLink1Description: Datasheet; ComponentLink1URL: http://tunmcdsvn.tun.st.com/Component_Datasheet_Library/Trunk/Resistors/Yageo_Resistor_RC0603-series
R291 = MCD-00065: as R237 on sheet Audio; Internal_Part_Number: MCD-00065; Status: Released; Part_Type: Resistor; Package: R0402; ComponentLink1Description: Datasheet; ComponentLink1URL: http://tunmcdsvn.tun.st.com/Component_Datasheet_Library/Trunk/Resistors/Yageo_Resistor_RC0402-series; Alternate_Manufacturer: YAGEO
TP10 TP11 = MCD-00074: Test Point 1mm; Part_Type: Mechanical; Initial_Board_Reference: MB1274; Path: ws/MCD_ApplicationBoards/Lists/MCDPARTSdatabase; Item Type: Item; Internal_Part_Number: MCD-00074; Provided_By: n/a; Status: Released; ComponentLink1Description: Datasheet; ComponentLink1URL: http://na; Manufacturer: n/a; Manufacturer_Part_Number: n/a
U42 = MCD-01162: Smartcard interfaces; Part_Type: IC; Manufacturer: STMICROELECTRONICS; BMS_Part_Number: 9177831; Provided_By: SUBCO with ST control; Initial_Board_Reference: MB1397; Remark: idem ST8024CTR; Path: ws/MCD_ApplicationBoards/Lists/MCDPARTSdatabase; Item Type: Item; Internal_Part_Number: MCD-01162; Status: Released; Manufacturer_Part_Number: ST8024LACDR; ComponentLink1Description: Datasheet; ComponentLink1URL: http://tunmcdsvn.tun.st.com/Component_Datasheet_Library/Trunk/IC/STM_Smartcard interface_ST8024L
U44 = MCD-00170: as U52 on sheet LCD&SDcard; Internal_Part_Number: MCD-00170; Status: Released; Manufacturer_Part_Number: ESDALC6V1-1U2; ComponentLink1Description: Datasheet; ComponentLink1URL: http://tunmcdsvn.tun.st.com/Component_Datasheet_Library/Trunk/Diodes/STM_ESD_ESDALC6V1-1U2